# Altium schematic sheet YL.SchDoc
size A4
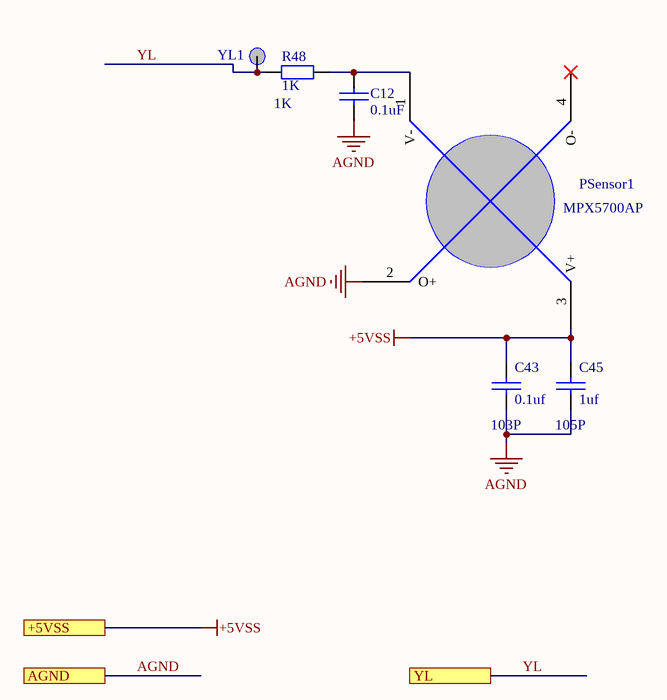
[diagram p0: YL.SchDoc]

## Parts
C12  0.1uF  [0805C]
C43  0.1uf  value 103P  [0805C]
C45  1uf  value 105P  [0805C]
PSensor1  MPX5700AP  [MPX5700AP]
R48  1K  [0805R]
YL1  (no value)  [TPP]

## Ports
+5VSS, AGND, YL

## Nets
+5VSS: C43.1 C45.2 PSensor1.3(V+) ; port +5VSS
AGND: C12.2 C43.2 C45.1 PSensor1.2(O+) ; port AGND
YL: R48.2 YL1.1 ; port YL
NetC12_1: C12.1 PSensor1.1(V-) R48.1

Not connected (* = marked no-connect by the designer): PSensor1 4(O-)*

## Library data of the parts
C12 = Cap
C43 C45 = Cap: Capacitor
PSensor1 = MPX
R48 = RES2: Resistor; Manufacturer: Generic Components; Class: Passive; Published: 08/06/2000; Publisher: Altium Hobart Technology Centre; SubClass: Resistor; Value: 1K
YL1 = TP